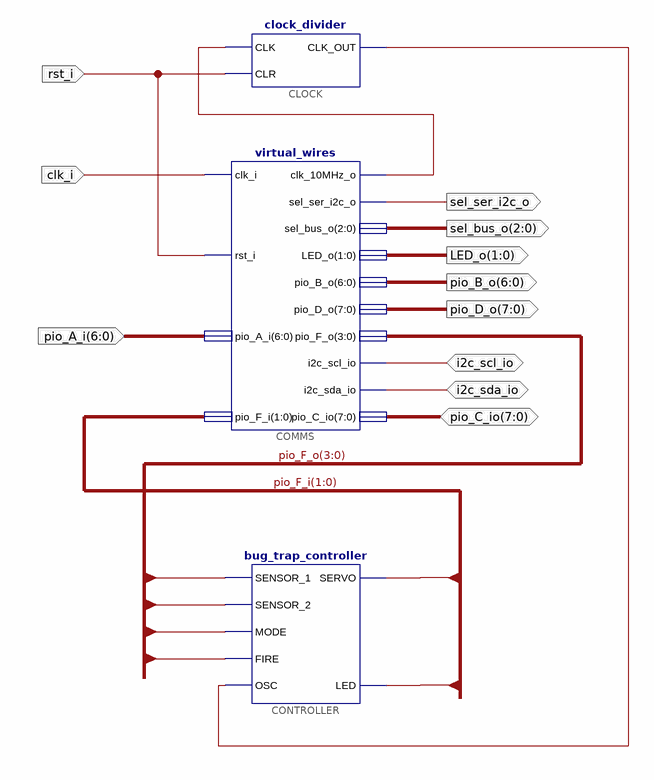
[diagram p0: schematic sheet 1]
// Xilinx ISE schematic bug_trap.sch (zynq) as structural Verilog: 3 symbols, 11 ports
module bug_trap (
  input  [6:0] pio_A_i,
  input  clk_i,
  input  rst_i,
  inout  [7:0] pio_C_io,
  inout  i2c_scl_io,
  inout  i2c_sda_io,
  output [7:0] pio_D_o,
  output [6:0] pio_B_o,
  output [1:0] LED_o,
  output [2:0] sel_bus_o,
  output sel_ser_i2c_o
);

  wire XLXN_5, XLXN_20;
  wire [1:0] pio_F_i;
  wire [3:0] pio_F_o;

  clock_divider CLOCK (.CLK(XLXN_5), .CLR(rst_i), .CLK_OUT(XLXN_20));
  virtual_wires COMMS (
    .clk_i(clk_i), .rst_i(rst_i), .pio_A_i(pio_A_i), .pio_F_i(pio_F_i), .clk_10MHz_o(XLXN_5),
    .sel_ser_i2c_o(sel_ser_i2c_o), .sel_bus_o(sel_bus_o), .LED_o(LED_o), .pio_B_o(pio_B_o),
    .pio_D_o(pio_D_o), .pio_F_o(pio_F_o), .i2c_scl_io(i2c_scl_io), .i2c_sda_io(i2c_sda_io),
    .pio_C_io(pio_C_io));
  bug_trap_controller CONTROLLER (
    .SENSOR_1(pio_F_o[3]), .SENSOR_2(pio_F_o[2]), .OSC(XLXN_20), .FIRE(pio_F_o[0]), .MODE(pio_F_o[1]),
    .LED(pio_F_i[1]), .SERVO(pio_F_i[0]));
endmodule
